# EasyEDA Pro project zkxh_robot_race_FOC_2025.eprj, board PCB4
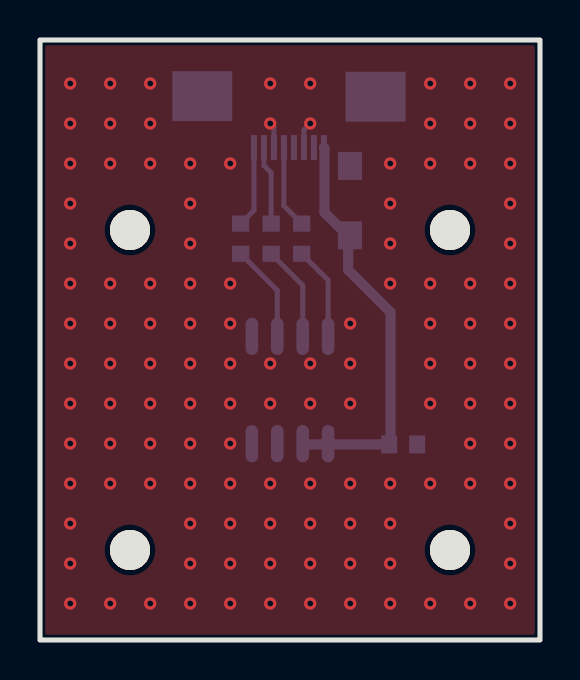
[diagram p4: board, top side]
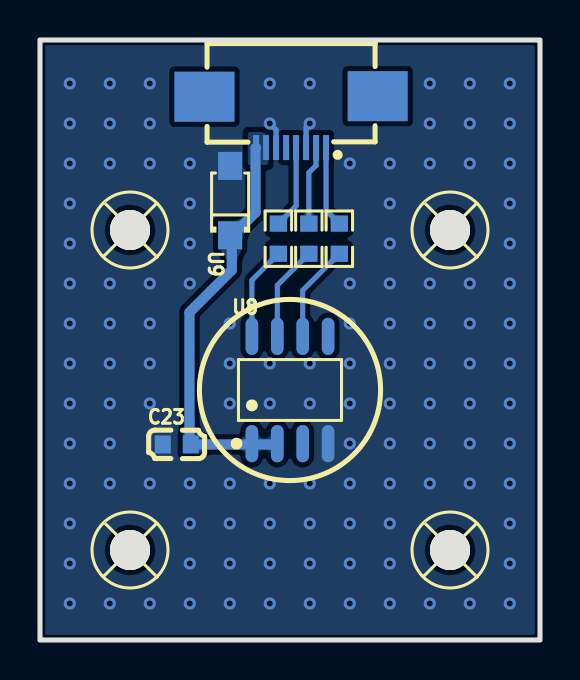
[diagram p5: board, bottom side, seen from below]

Outline 25 x 30 mm; copper layers: Top Layer, Bottom Layer. Coordinates in mm from the lower left corner of the outline.
Outline path: rectangle 0,30 25,0
Stack: Top Layer 0.035mm / Dielectric1 1.51mm FR4 er 4.5 / Bottom Layer 0.035mm

## Design rules (mm)
template: 自定义配置1
spacing copperThickness1oz (default): track to track 0.102, other pairs 0.152 to 0.3
spacing copperThickness2oz: track to track 0.203, other pairs 0.152 to 0.3
track width copperThickness1oz (default): min 0.127, default 0.254, max 2.54
track width copperThickness2oz: min 0.203, default 0.508, max 2.54
differential pair differentialPair (default): width min 0.127, default 0.254, max 2.54; gap min 0.152, default 0.152
via viaSize (default): diameter min 0.5, default 0.61, max 10; hole min 0.3, default 0.305, max 6.299
net VCC uses copperRegionAll, copperThickness2oz
net GND uses copperRegionAll

## Placement (name value [footprint] x y rotation side)
C23  100nF  [C0603]  18.16 9.78 180 bottom
FPC1  FPC-05F-8PH20  [FPC-SMD_8P-P0.50_FPC-05F-8PH20]  12.45 25.91 0 bottom
R25  100Ω  [R0603]  13.08 20.07 90 bottom
R26  100Ω  [R0603]  11.56 20.07 90 bottom
R27  100Ω  [R0603]  10.03 20.07 90 bottom
SCREW1  -  [M2螺丝]  20.5 20.5 180 bottom
SCREW2  -  [M2螺丝]  4.5 20.5 180 bottom
SCREW3  -  [M2螺丝]  4.5 4.5 180 bottom
SCREW4  -  [M2螺丝]  20.5 4.5 180 bottom
U8  MT6701CT-STD  [SOP-8_L4.9-W3.9-P1.27-LS6.0-BL]  12.5 12.5 180 bottom
U9  SMF6.0CA  [SOD-123FL_L2.7-W1.8-LS3.8-RD]  15.49 21.97 90 bottom

## Footprints (pads in the part's own frame, mm; a bottom-side part is the same pattern mirrored in y, then rotated)
C0603
  rect 0.8x0.9 smd: 1(-0.7,0) 2(0.7,0)
FPC-SMD_8P-P0.50_FPC-05F-8PH20
  rect 0.3x1.25 smd: 1(-1.75,1.288) 2(-1.25,1.288) 3(-0.75,1.288) 4(-0.25,1.288) 5(0.25,1.288) 6(0.75,1.288) 7(1.25,1.288) 8(1.75,1.288)
  rect 3x2.5 smd: 9(4.33,-1.258) 10(-4.33,-1.282)
M2螺丝
  round 2 hole 2: 1(0,0)
R0603
  rect 0.806x0.864 smd: 1(-0.753,0) 2(0.753,0)
SOD-123FL_L2.7-W1.8-LS3.8-RD
  rect 1.4x1.2 smd: 1(-1.735,0) 2(1.735,0)
SOP-8_L4.9-W3.9-P1.27-LS6.0-BL
  oval 0.63x1.865 smd: 1(-1.905,-2.683) 2(-0.635,-2.683) 3(0.635,-2.683) 4(1.905,-2.683) 5(1.905,2.683) 6(0.635,2.683) 7(-0.635,2.683) 8(-1.905,2.683)

## Nets
As in the schematic.

Pads without a net: FPC1 5 9 10; SCREW1 1; SCREW2 1; SCREW3 1; SCREW4 1; U8 3 5

## Via types
v1: diameter 0.61, hole 0.305, Top Layer to Bottom Layer, 120 vias

## Routing (per net, layer and track width the routed paths; a pad name or vN(x,y) marks a point on that pad's centre or on a via; arc(x,y) is an arc through that point)
GND: length 2.6
  Bottom Layer w0.254: v1(11.51,25.83) 11.7,25.64 FPC1.3 ; FPC1.6 13.2,25.51 v1(13.51,25.83)
  vias: v1(1.51,27.83) v1(1.51,25.83) v1(1.51,23.83) v1(1.51,21.83) v1(1.51,19.83) v1(1.51,17.83) v1(1.51,15.83) v1(1.51,13.83) v1(1.51,11.83) v1(1.51,9.83) v1(1.51,7.83) v1(1.51,5.83) v1(1.51,3.83) v1(1.51,1.83) v1(3.51,27.83) v1(3.51,25.83) v1(3.51,23.83) v1(3.51,17.83) v1(3.51,15.83) v1(3.51,13.83) v1(3.51,11.83) v1(3.51,9.83) v1(3.51,7.83) v1(3.51,1.83) v1(5.51,27.83) v1(5.51,25.83) v1(5.51,23.83) v1(5.51,17.83) v1(5.51,15.83) v1(5.51,13.83) v1(5.51,11.83) v1(5.51,9.83) v1(5.51,7.83) v1(5.51,1.83) v1(7.51,23.83) v1(7.51,21.83) v1(7.51,19.83) v1(7.51,17.83) v1(7.51,15.83) v1(7.51,13.83) v1(7.51,11.83) v1(7.51,9.83) v1(7.51,7.83) v1(7.51,5.83) v1(7.51,3.83) v1(7.51,1.83) v1(9.51,23.83) v1(9.51,17.83) v1(9.51,15.83) v1(9.51,13.83) v1(9.51,11.83) v1(9.51,9.83) v1(9.51,7.83) v1(9.51,5.83) v1(9.51,3.83) v1(9.51,1.83) v1(11.51,27.83) v1(11.51,13.83) v1(11.51,11.83) v1(11.51,7.83) v1(11.51,5.83) v1(11.51,3.83) v1(11.51,1.83) v1(13.51,27.83) v1(13.51,13.83) v1(13.51,11.83) v1(13.51,7.83) v1(13.51,5.83) v1(13.51,3.83) v1(13.51,1.83) v1(15.51,15.83) v1(15.51,13.83) v1(15.51,11.83) v1(15.51,7.83) v1(15.51,5.83) v1(15.51,3.83) v1(15.51,1.83) v1(17.51,23.83) v1(17.51,21.83) v1(17.51,19.83) v1(17.51,17.83) v1(17.51,7.83) v1(17.51,5.83) v1(17.51,3.83) v1(17.51,1.83) v1(19.51,27.83) v1(19.51,25.83) v1(19.51,23.83) v1(19.51,17.83) v1(19.51,15.83) v1(19.51,13.83) v1(19.51,11.83) v1(19.51,7.83) v1(19.51,1.83) v1(21.51,27.83) v1(21.51,25.83) v1(21.51,23.83) v1(21.51,17.83) v1(21.51,15.83) v1(21.51,13.83) v1(21.51,11.83) v1(21.51,9.83) v1(21.51,7.83) v1(21.51,1.83) v1(23.51,27.83) v1(23.51,25.83) v1(23.51,23.83) v1(23.51,21.83) v1(23.51,19.83) v1(23.51,17.83) v1(23.51,15.83) v1(23.51,13.83) v1(23.51,11.83) v1(23.51,9.83) v1(23.51,7.83) v1(23.51,5.83) v1(23.51,3.83) v1(23.51,1.83)
VCC: length 20.6
  Bottom Layer w0.508: FPC1.8 14.22,24.59 14.22,21.38 15.41,20.19 15.41,18.5 17.53,16.38 17.53,9.84 C23.2 13.17,9.78 U8.2
SPI_MISO: length 4.1
  Bottom Layer w0.254: FPC1.1 10.7,21.48 R27.2
SPI_NSS: length 4.2
  Bottom Layer w0.254: R25.2 12.19,21.71 12.19,24.62 FPC1.4
SPI_SCK: length 4
  Bottom Layer w0.254: R26.2 11.56,23.37 11.2,23.73 FPC1.2
$1N485: length 4.7
  Bottom Layer w0.254: R25.1 14.41,17.99 U8.8
$1N487: length 4.9
  Bottom Layer w0.254: U8.6 11.87,17.48 R27.1
$1N492: length 4.8
  Bottom Layer w0.254: U8.7 13.13,17.73 R26.1

## Copper pours and planes (outline as drawn; the poured copper is in the pictures)
GND on Top Layer: -6.22,34.8 33.02,34.8 33.02,-8.38 -6.22,-8.38
GND on Bottom Layer: -13.72,39.62 27.94,39.62 27.94,-1.65 -13.72,-1.65
VCC on Bottom Layer: 13.59,25.4 14.6,25.4 14.6,23.75 13.59,23.75

Small or netless copper shapes (teardrops, artwork), in the pictures only: 23 on Bottom Layer

## Text on the board
Top Solder Mask Layer: 2025机器人大赛 / 成都工业学院
